# Altium schematic sheet Inputs.SchDoc: Inputs
size A4; SheetNumber: 5; SheetTotal: 8
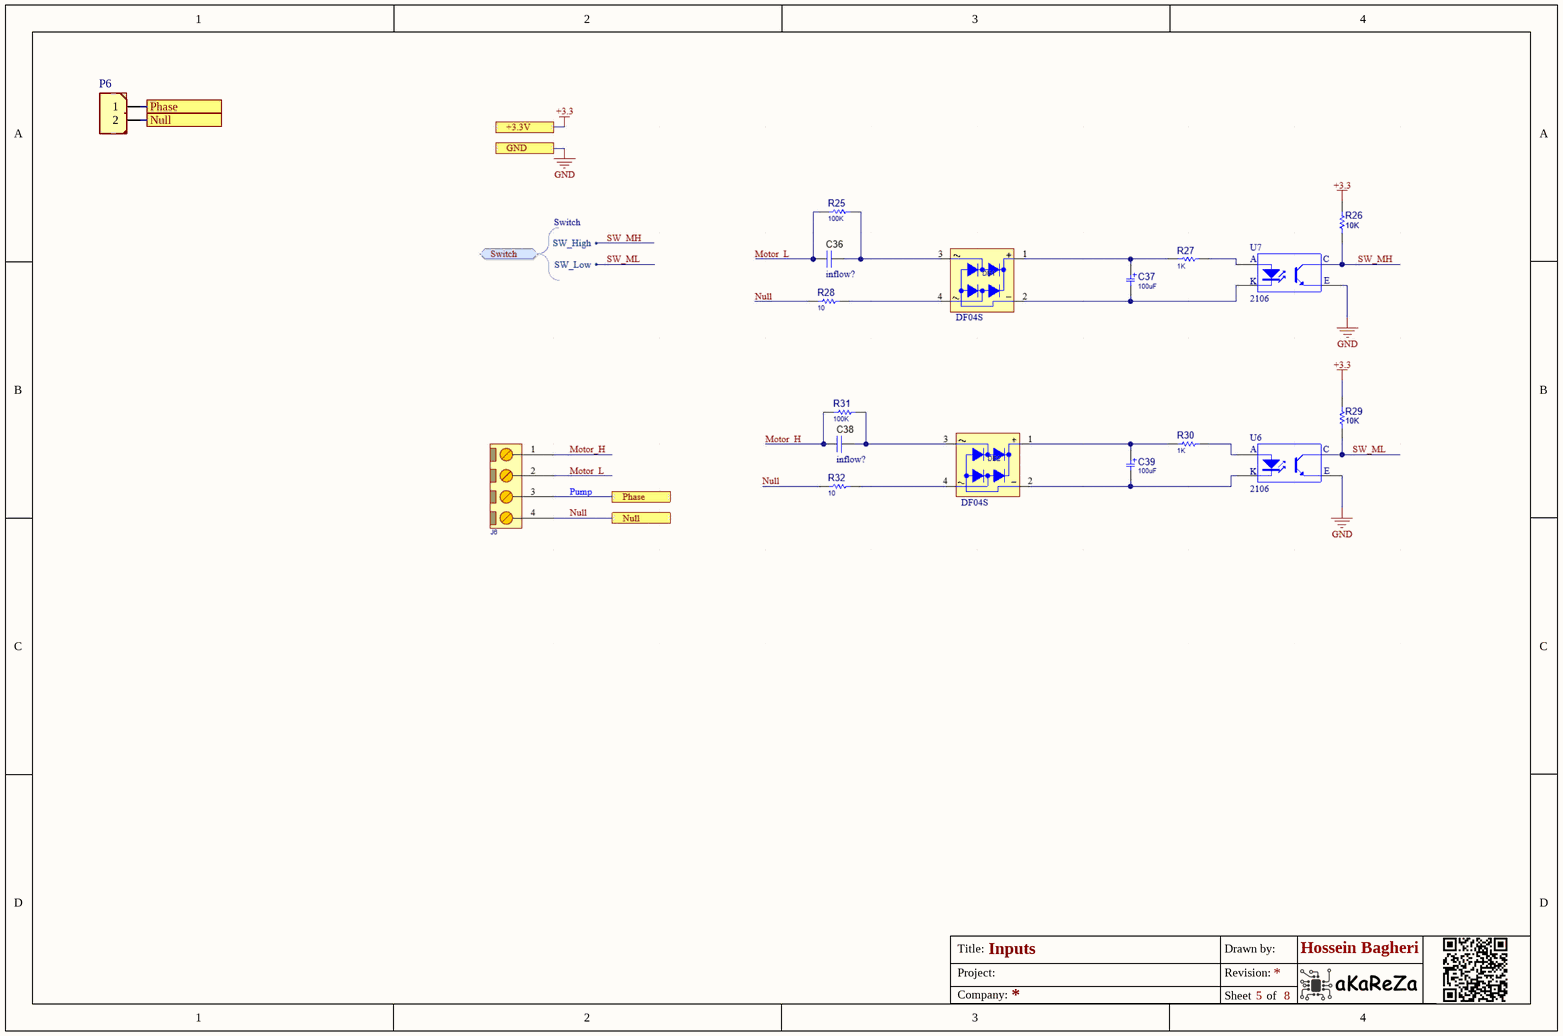
[diagram p0: Inputs.SchDoc]

## Parts
P6  2'Pin  [Phoenix_2PIN_RA_P5.08mm]  (value not drawn)

## Ports
Null, Phase

## Nets
Null: P6.2 ; port Null
Phase: P6.1 ; port Phase

## Notes on the sheet
- Title:
- Project:
- Drawn by:
- Revision:
- Hossein Bagheri
- Company:
- Sheet
- of

## Library data of the parts
P6 = Con_Power_2: Power Connector 2'Pin; Rating: Rating?; Validation: NT; Inflow: inflow?; Value: 2'Pin; Package: Package?; Type: Type?